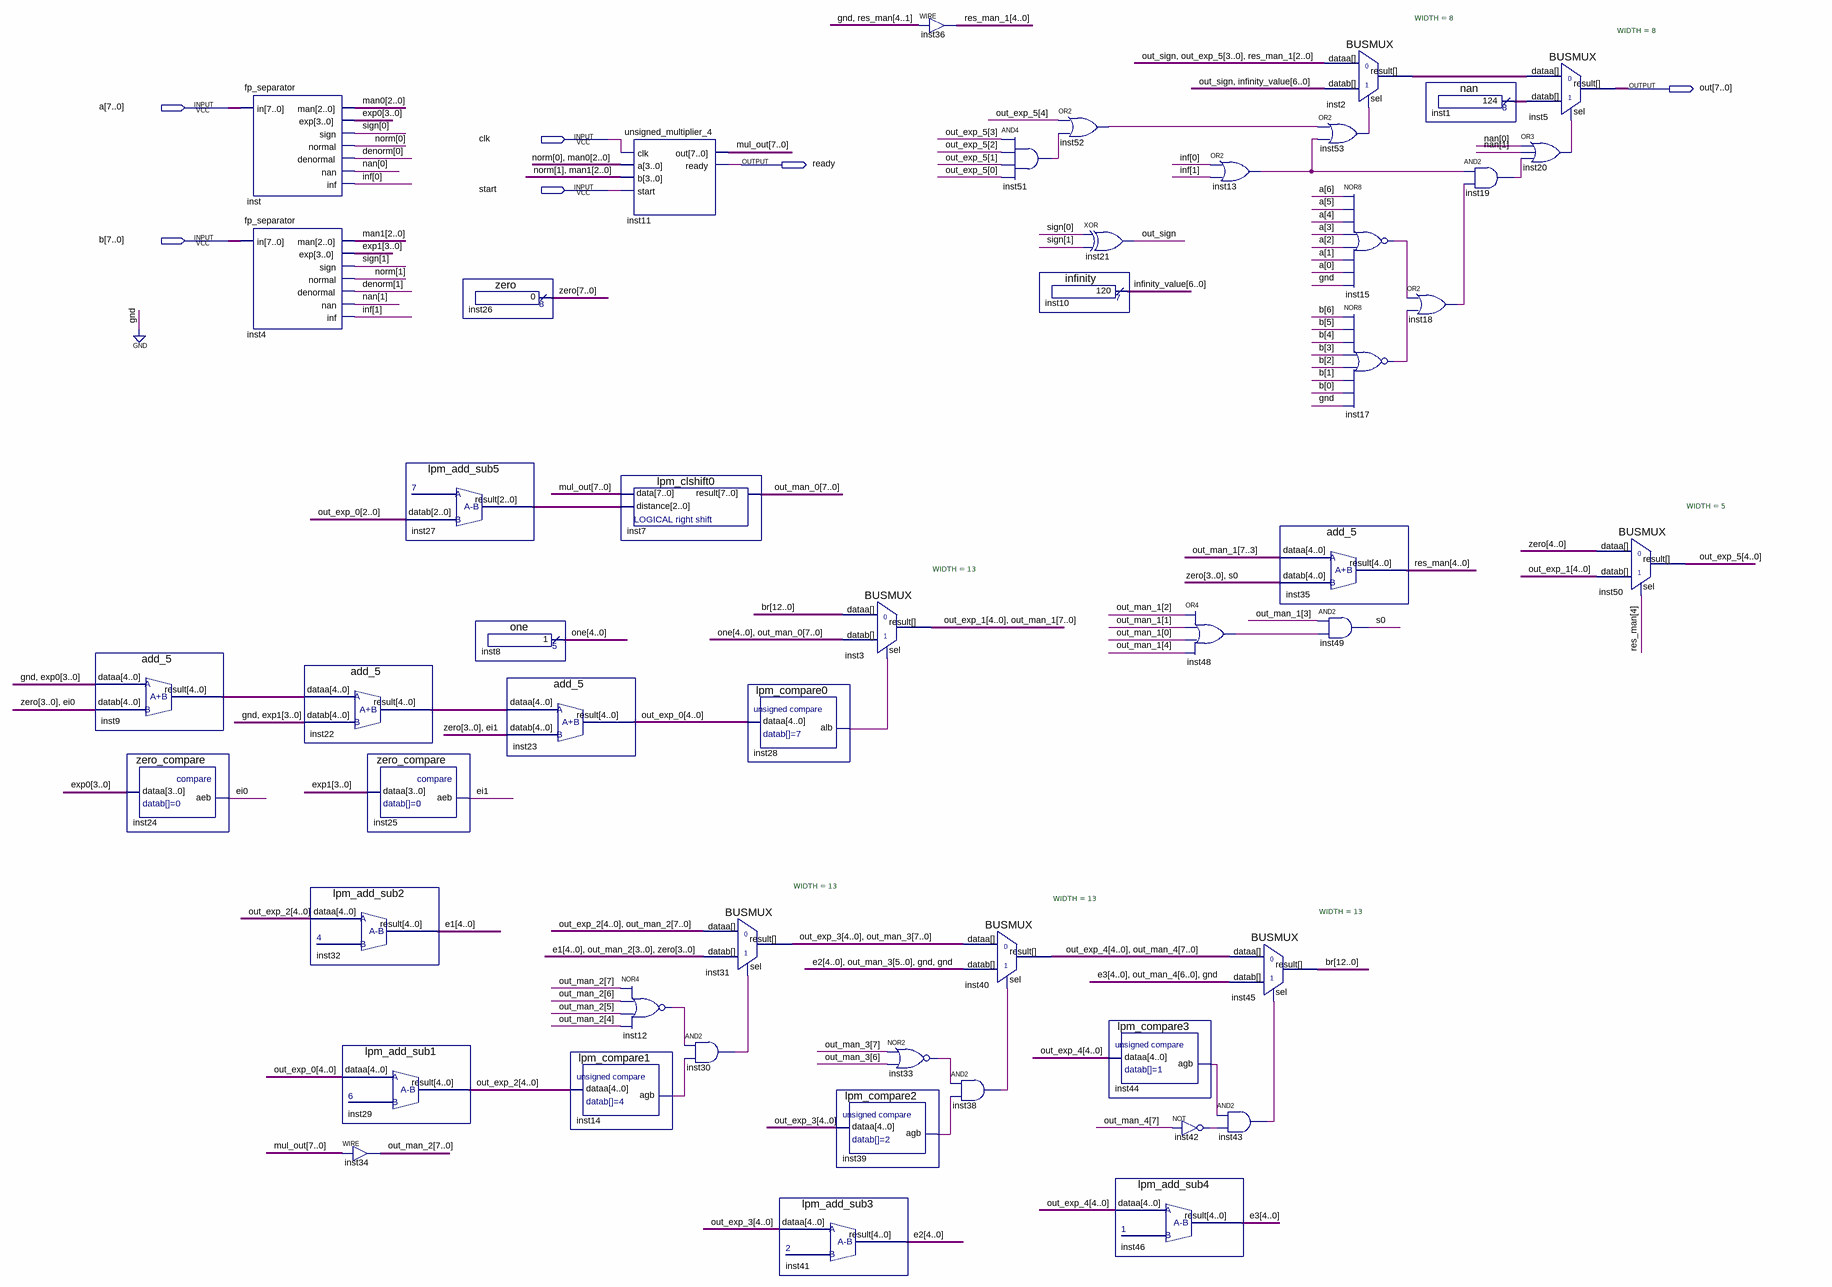
[diagram p0: schematic sheet]
// Quartus schematic fp_mul.bdf as structural Verilog: 50 symbols, 6 pins
module fp_mul (
  input  [7:0] a,
  input  clk,
  input  start,
  input  [7:0] b,
  output [7:0] out,
  output ready
);

  wire ei0, ei1, inst12_out, inst13_out, inst14_agb, inst15_out, inst17_out, inst18_out, inst19_out,
       inst20_out, inst28_alb, inst30_out, inst33_out, inst38_out, inst39_agb, inst42_out, inst43_out,
       inst44_agb, inst48_out, inst51_out, inst52_out, inst53_out, out_sign, s0;
  wire [1:0] denorm, inf, nan, norm, sign;
  wire [2:0] inst27_result, man0, man1;
  wire [3:0] exp0, exp1;
  wire [4:0] e1, e2, e3, inst9_result, inst22_result, one, out_exp_0, out_exp_1, out_exp_2, out_exp_3,
       out_exp_4, out_exp_5, res_man, res_man_1;
  wire [6:0] infinity_value;
  wire [7:0] inst1_result, inst2_result, mul_out, out_man_0, out_man_1, out_man_2, out_man_3, out_man_4, zero;
  wire [12:0] br;

  add_5 inst9 (.dataa({1'b0, exp0}), .datab({zero[3:0], ei0}), .result(inst9_result));
  zero_compare inst24 (.dataa(exp0), .aeb(ei0));
  fp_separator inst (
    .in(a), .man(man0), .exp(exp0), .sign(sign[0]), .normal(norm[0]), .denormal(denorm[0]), .nan(nan[0]),
    .inf(inf[0]));
  fp_separator inst4 (
    .in(b), .man(man1), .exp(exp1), .sign(sign[1]), .normal(norm[1]), .denormal(denorm[1]), .nan(nan[1]),
    .inf(inf[1]));
  add_5 inst22 (.dataa(inst9_result), .datab({1'b0, exp1}), .result(inst22_result));
  lpm_add_sub2 inst32 (.dataa(out_exp_2), .result(e1));
  zero_compare inst25 (.dataa(exp1), .aeb(ei1));
  lpm_add_sub1 inst29 (.dataa(out_exp_0), .result(out_exp_2));
  assign out_man_2 = mul_out;  // WIRE inst34
  lpm_add_sub5 inst27 (.datab(out_exp_0[2:0]), .result(inst27_result));
  zero inst26 (.result(zero));
  one inst8 (.result(one));
  add_5 inst23 (.dataa(inst22_result), .datab({zero[3:0], ei1}), .result(out_exp_0));
  lpm_compare1 inst14 (.dataa(out_exp_2), .agb(inst14_agb));
  unsigned_multiplier_4 inst11 (
    .clk(clk), .a({norm[0], man0}), .b({norm[1], man1}), .start(start), .out(mul_out), .ready(ready));
  lpm_clshift0 inst7 (.data(mul_out), .distance(inst27_result), .result(out_man_0));
  nor inst12 (inst12_out, out_man_2[7], out_man_2[6], out_man_2[5], out_man_2[4]);
  BUSMUX #(.WIDTH(13)) inst31 (
    .datab({e1, out_man_2[3:0], zero[3:0]}), .sel(inst30_out), .dataa({out_exp_2, out_man_2}),
    .result({out_exp_3, out_man_3}));
  and inst30 (inst30_out, inst12_out, inst14_agb);
  lpm_compare0 inst28 (.dataa(out_exp_0), .alb(inst28_alb));
  lpm_add_sub3 inst41 (.dataa(out_exp_3), .result(e2));
  BUSMUX #(.WIDTH(13)) inst3 (.datab({one, out_man_0}), .sel(inst28_alb), .dataa(br), .result({out_exp_1, out_man_1}));
  lpm_compare2 inst39 (.dataa(out_exp_3), .agb(inst39_agb));
  assign res_man_1 = {1'b0, res_man[4:1]};  // WIRE inst36
  nor inst33 (inst33_out, out_man_3[7], out_man_3[6]);
  BUSMUX #(.WIDTH(13)) inst40 (
    .datab({e2, out_man_3[5:0], 2'b00}), .sel(inst38_out), .dataa({out_exp_3, out_man_3}),
    .result({out_exp_4, out_man_4}));
  and inst38 (inst38_out, inst33_out, inst39_agb);
  and inst51 (inst51_out, out_exp_5[3], out_exp_5[2], out_exp_5[1], out_exp_5[0]);
  or inst52 (inst52_out, out_exp_5[4], inst51_out);
  infinity inst10 (.result(infinity_value));
  xor inst21 (out_sign, sign[0], sign[1]);
  lpm_compare3 inst44 (.dataa(out_exp_4), .agb(inst44_agb));
  lpm_add_sub4 inst46 (.dataa(out_exp_4), .result(e3));
  not inst42 (inst42_out, out_man_4[7]);
  or inst13 (inst13_out, inf[0], inf[1]);
  or inst48 (inst48_out, out_man_1[2], out_man_1[1], out_man_1[0], out_man_1[4]);
  BUSMUX #(.WIDTH(13)) inst45 (
    .datab({e3, out_man_4[6:0], 1'b0}), .sel(inst43_out), .dataa({out_exp_4, out_man_4}), .result(br));
  and inst43 (inst43_out, inst44_agb, inst42_out);
  add_5 inst35 (.dataa(out_man_1[7:3]), .datab({zero[3:0], s0}), .result(res_man));
  BUSMUX #(.WIDTH(8)) inst2 (
    .datab({out_sign, infinity_value}), .sel(inst53_out), .dataa({out_sign, out_exp_5[3:0], res_man_1[2:0]}),
    .result(inst2_result));
  or inst53 (inst53_out, inst52_out, inst13_out);
  and inst49 (s0, out_man_1[3], inst48_out);
  nor inst15 (inst15_out, a[6], a[5], a[4], a[3], a[2], a[1], a[0], 1'b0);
  nor inst17 (inst17_out, b[6], b[5], b[4], b[3], b[2], b[1], b[0], 1'b0);
  nan inst1 (.result(inst1_result));
  or inst18 (inst18_out, inst15_out, inst17_out);
  and inst19 (inst19_out, inst13_out, inst18_out);
  BUSMUX #(.WIDTH(8)) inst5 (.datab(inst1_result), .sel(inst20_out), .dataa(inst2_result), .result(out));
  or inst20 (inst20_out, nan[0], nan[1], inst19_out);
  BUSMUX #(.WIDTH(5)) inst50 (.datab(out_exp_1), .sel(res_man[4]), .dataa(zero[4:0]), .result(out_exp_5));
endmodule
